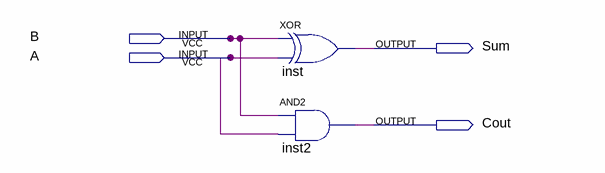
[diagram p0: schematic sheet]
// Quartus schematic HA.bdf as structural Verilog: 2 symbols, 4 pins
module HA (
  input  B,
  input  A,
  output Sum,
  output Cout
);

  xor inst (Sum, B, A);
  and inst2 (Cout, B, A);
endmodule
